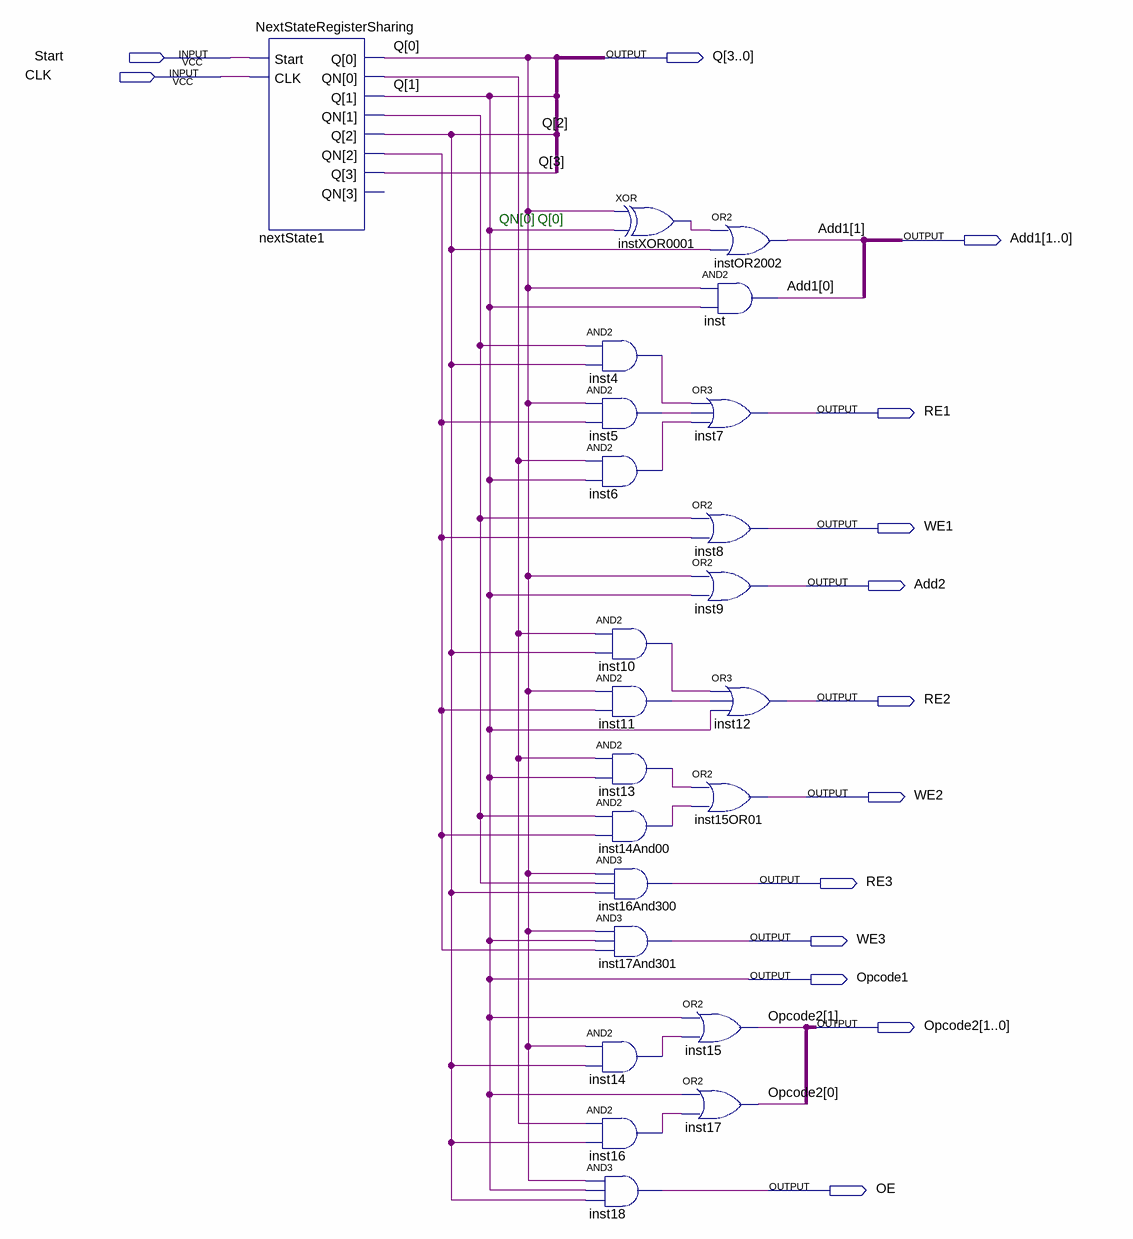
[diagram p0: schematic sheet]
// Quartus schematic ControlFunctionSharing.bdf as structural Verilog: 23 symbols, 14 pins
module ControlFunctionSharing (
  input  Start,
  input  CLK,
  output [3:0] Q,
  output [1:0] Add1,
  output RE1,
  output WE1,
  output Add2,
  output RE2,
  output WE2,
  output RE3,
  output WE3,
  output Opcode1,
  output [1:0] Opcode2,
  output OE
);

  wire inst4_out, inst5_out, inst6_out, inst10_out, inst11_out, inst13_out, inst14_out, inst14And00_out,
       inst16_out, instXOR0001_out, nextState1_qn, nextState1_qn_2, nextState1_qn_3;
  wire [3:0] nextState1_qn_open;  // unused outputs

  NextStateRegisterSharing nextState1 (
    .Start(Start), .CLK(CLK), .Q({Q[3:2], Opcode1, Q[0]}),
    .QN({nextState1_qn_open[3], nextState1_qn_2, nextState1_qn, nextState1_qn_3}));
  xor instXOR0001 (instXOR0001_out, Q[0], Opcode1);
  and inst4 (inst4_out, nextState1_qn, Q[2]);
  and inst5 (inst5_out, Q[0], nextState1_qn_2);
  and inst6 (inst6_out, nextState1_qn_3, Opcode1);
  and inst10 (inst10_out, nextState1_qn_3, Q[2]);
  and inst11 (inst11_out, Q[0], nextState1_qn_2);
  and inst13 (inst13_out, nextState1_qn_3, Opcode1);
  and inst14And00 (inst14And00_out, nextState1_qn, nextState1_qn_2);
  and inst16And300 (RE3, Q[0], nextState1_qn, Q[2]);
  and inst17And301 (WE3, Q[0], Opcode1, nextState1_qn_2);
  and inst14 (inst14_out, Q[0], Q[2]);
  and inst16 (inst16_out, nextState1_qn_3, Q[2]);
  and inst18 (OE, Q[0], Opcode1, Q[2]);
  or inst7 (RE1, inst4_out, inst5_out, inst6_out);
  or inst8 (WE1, nextState1_qn, nextState1_qn_2);
  or inst9 (Add2, Q[0], Opcode1);
  or inst15OR01 (WE2, inst13_out, inst14And00_out);
  or inst15 (Opcode2[1], Opcode1, inst14_out);
  or inst17 (Opcode2[0], Opcode1, inst16_out);
  or instOR2002 (Add1[1], instXOR0001_out, Q[2]);
  and inst (Add1[0], Q[0], Opcode1);
  or inst12 (RE2, inst10_out, inst11_out, Opcode1);

  assign Q[1] = Opcode1;

  // Notes on the sheet:
  //   QN[0]
  //   Q[0]
endmodule
